# EasyEDA Pro project XRAY.epro, board PCB8
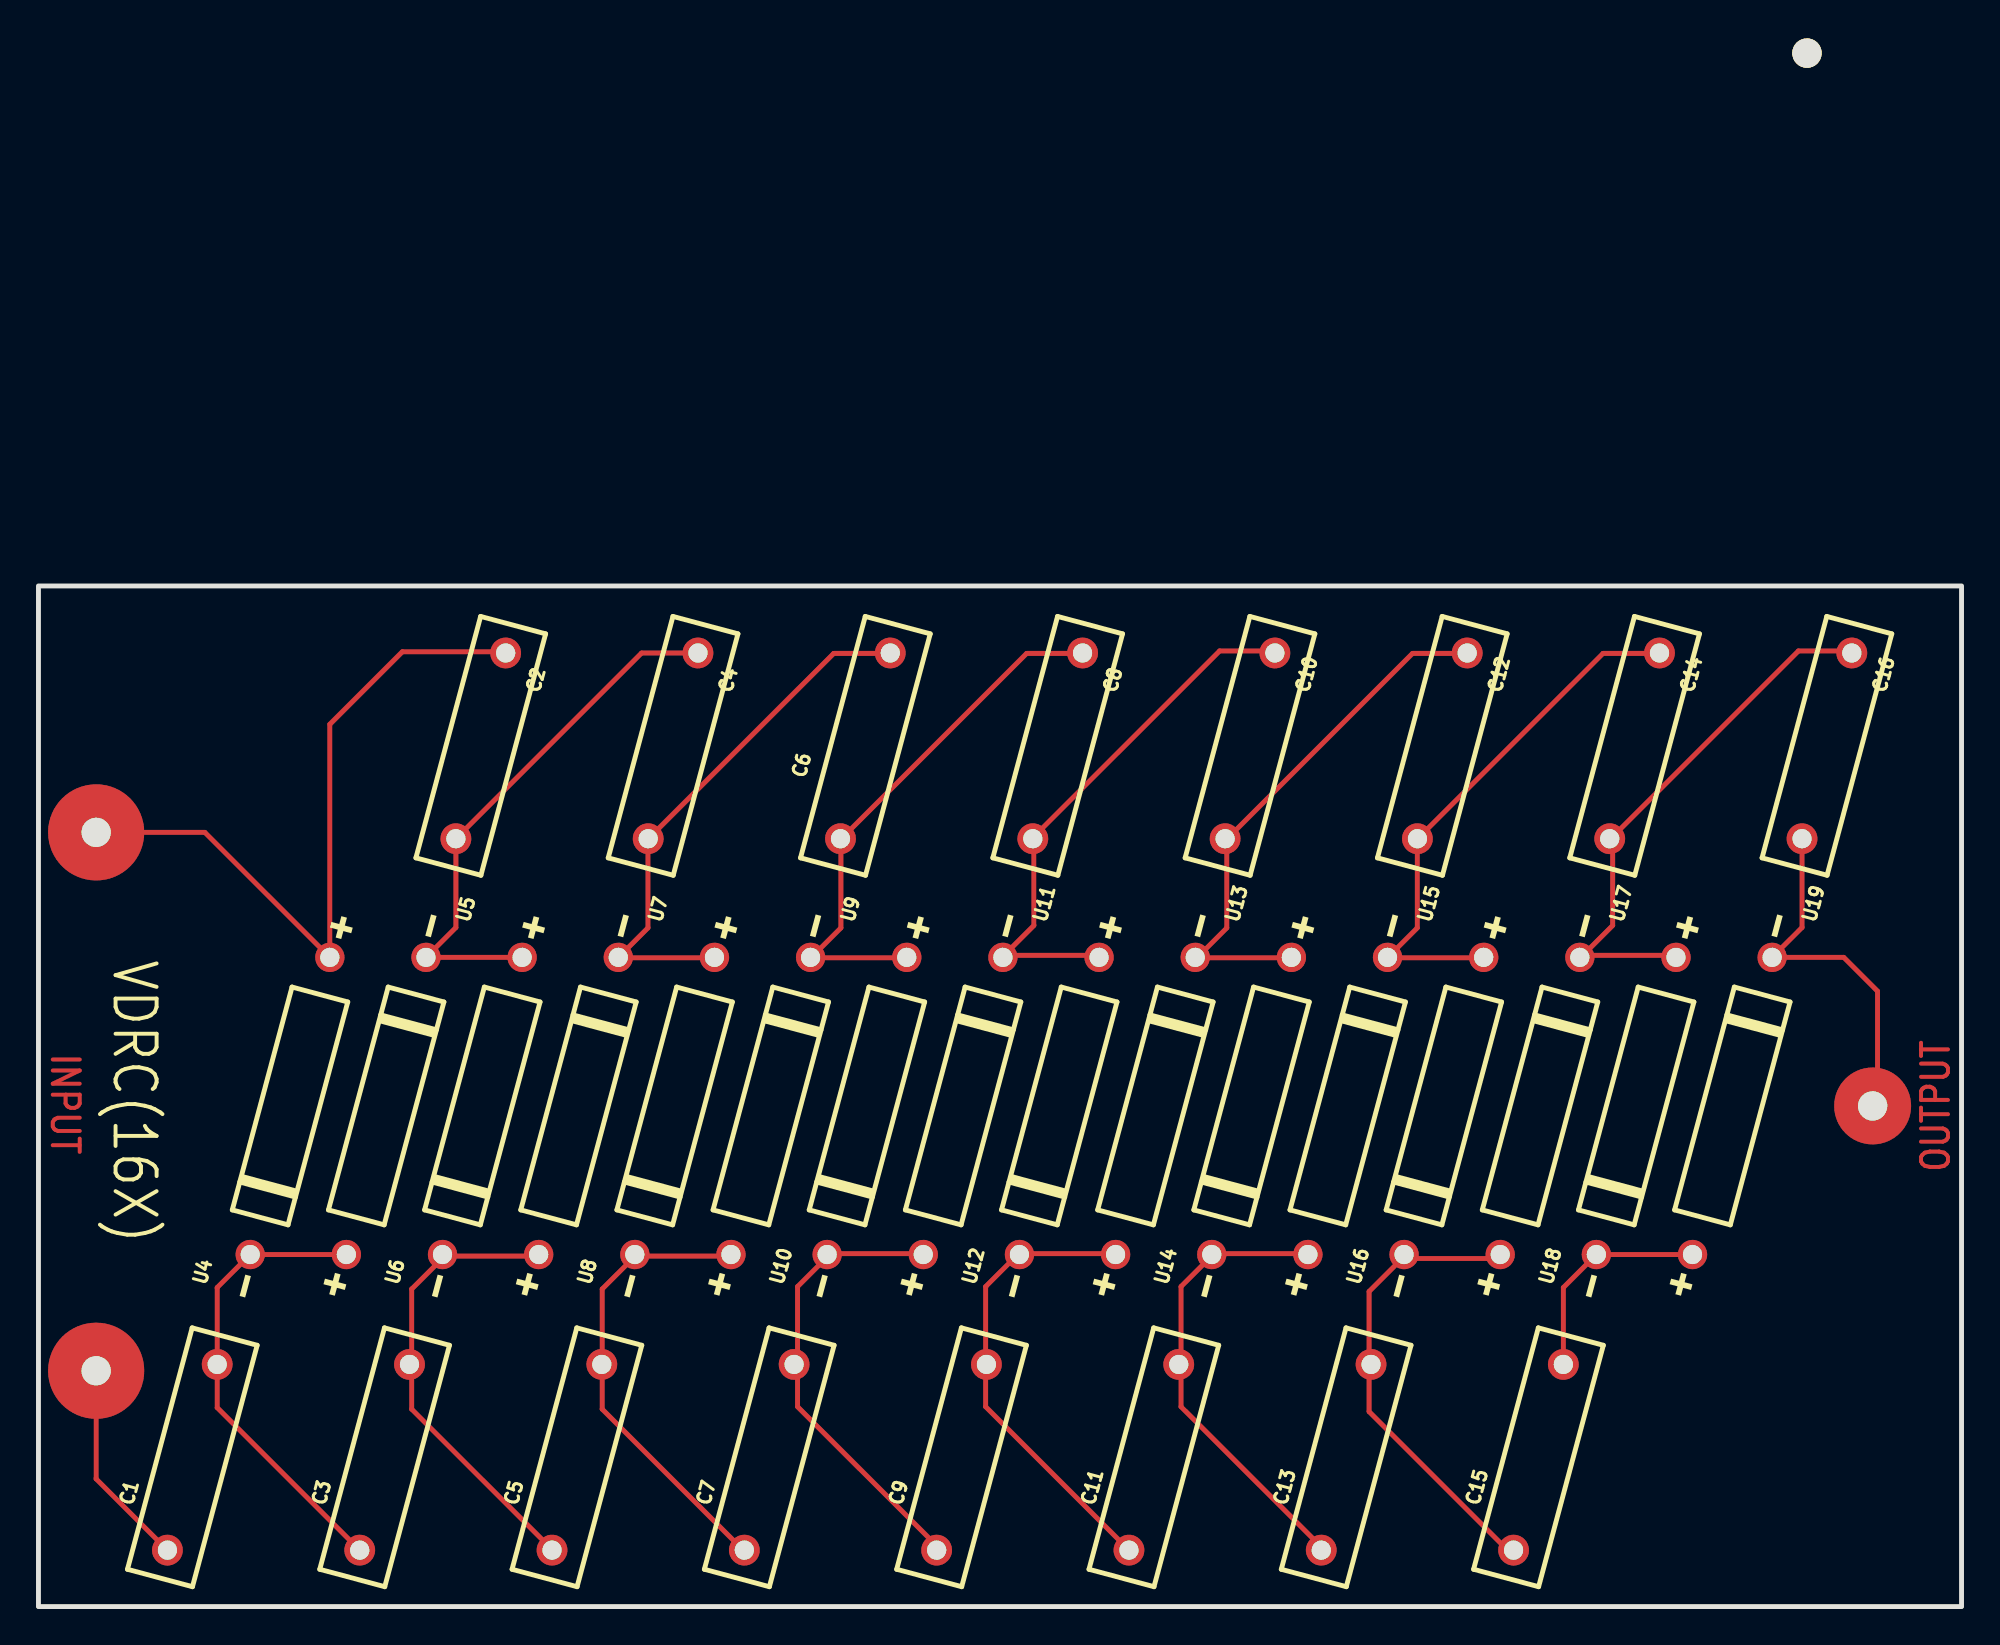
[diagram p5: board, top side]
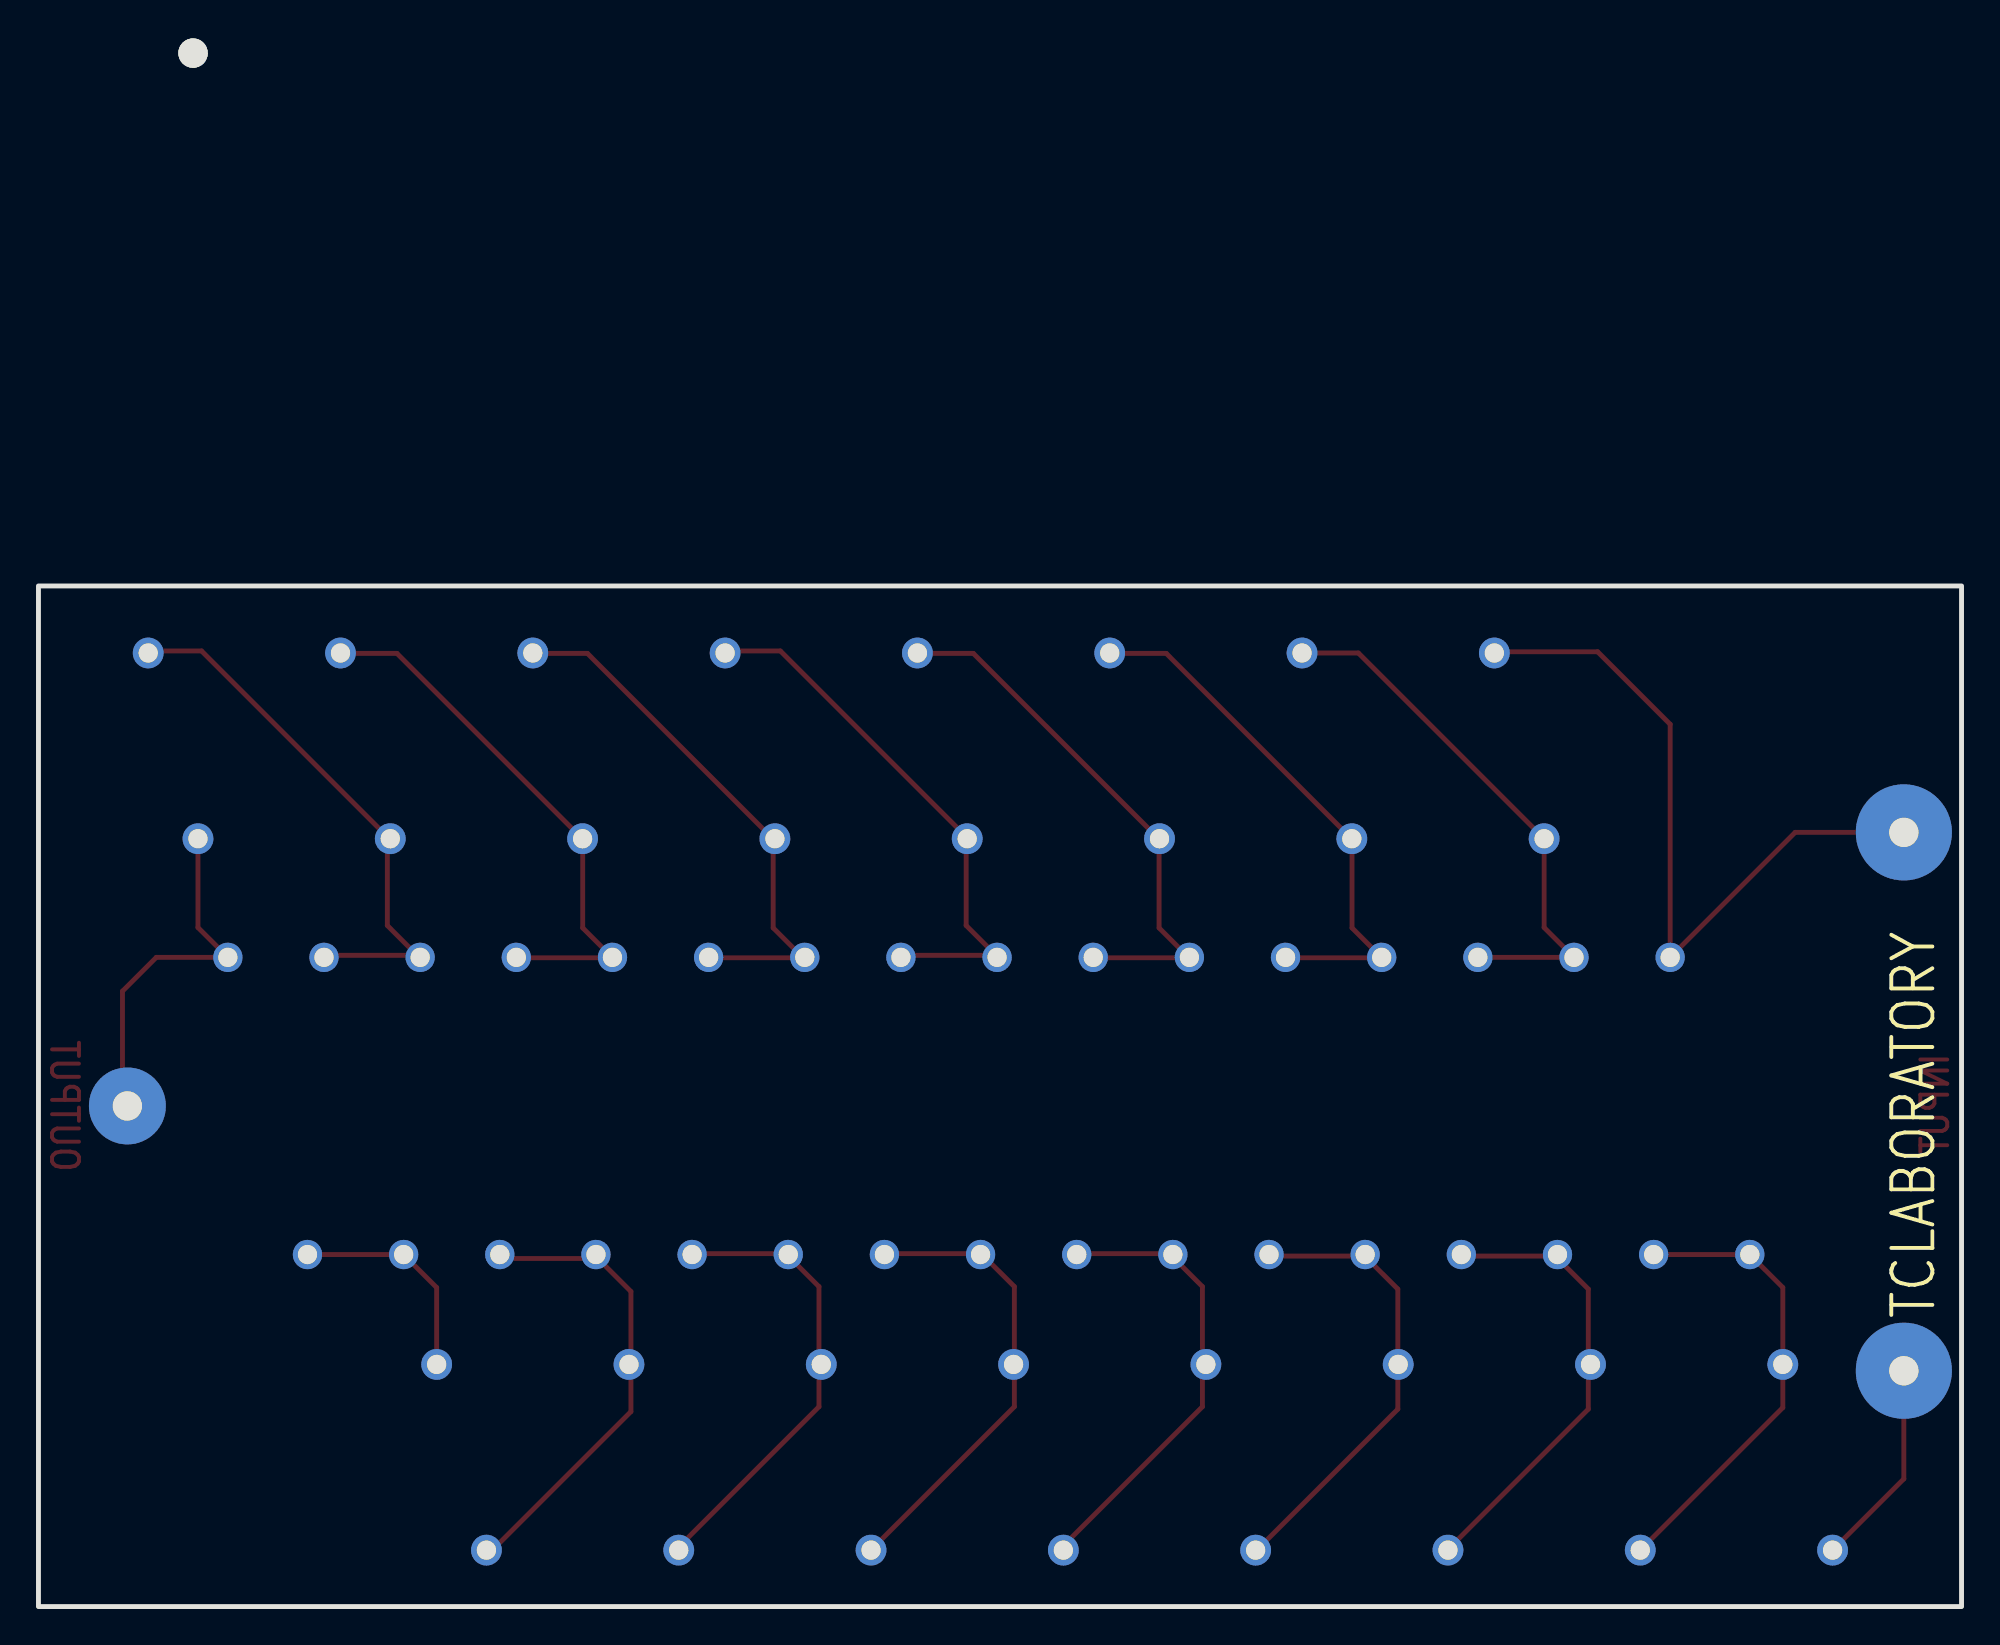
[diagram p6: board, bottom side, seen from below]

Outline 100 x 53.08 mm; copper layers: Top Layer, Bottom Layer. Coordinates in mm from the lower left corner of the outline.
Outline path: rectangle 0,53.08 100,0
Stack: Top Layer 0.035mm / Dielectric1 1.51mm FR4 er 4.5 / Bottom Layer 0.035mm

## Design rules (mm)
template: JLCPCB Capability(Two Layers Board)
spacing copperThickness1oz (default): track to track 0.102, other pairs 0.152 to 0.3
spacing copperThickness2oz: track to track 0.203, other pairs 0.152 to 0.3
track width copperThickness1oz (default): min 0.127, default 0.254, max 2.54
track width copperThickness2oz: min 0.203, default 0.254, max 2.54
differential pair differentialPair (default): width min 0.127, default 0.254, max 2.54; gap min 0.152, default 0.152
via viaSize (default): diameter min 0.5, default 0.61, max 10; hole min 0.3, default 0.305, max 6.3

## Placement (name value [footprint] x y rotation side)
C1  10nF  [CAP-TH_L13.0-W3.5-P10.00-D1.0]  8 7.76 75 top
C2  10nF  [CAP-TH_L13.0-W3.5-P10.00-D1.0]  23 44.76 255 top
C3  10nF  [CAP-TH_L13.0-W3.5-P10.00-D1.0]  18 7.76 75 top
C4  10nF  [CAP-TH_L13.0-W3.5-P10.00-D1.0]  33 44.76 255 top
C5  10nF  [CAP-TH_L13.0-W3.5-P10.00-D1.0]  28 7.76 75 top
C6  10nF  [CAP-TH_L13.0-W3.5-P10.00-D1.0]  43 44.76 255 top
C7  10nF  [CAP-TH_L13.0-W3.5-P10.00-D1.0]  38 7.76 75 top
C8  10nF  [CAP-TH_L13.0-W3.5-P10.00-D1.0]  53 44.76 255 top
C9  10nF  [CAP-TH_L13.0-W3.5-P10.00-D1.0]  48 7.76 75 top
C10  10nF  [CAP-TH_L13.0-W3.5-P10.00-D1.0]  63 44.76 255 top
C11  10nF  [CAP-TH_L13.0-W3.5-P10.00-D1.0]  58 7.76 75 top
C12  10nF  [CAP-TH_L13.0-W3.5-P10.00-D1.0]  73 44.76 255 top
C13  10nF  [CAP-TH_L13.0-W3.5-P10.00-D1.0]  68 7.76 75 top
C14  10nF  [CAP-TH_L13.0-W3.5-P10.00-D1.0]  83 44.76 255 top
C15  10nF  [CAP-TH_L13.0-W3.5-P10.00-D1.0]  78 7.76 75 top
C16  10nF  [CAP-TH_L13.0-W3.5-P10.00-D1.0]  93 44.76 255 top
NOREF  -  [Pad_e34]  3 12.26 0 top
NOREF#2  -  [Pad_e35]  91.96 80.79 0 top
NOREF#3  -  [Pad_e39]  3 40.26 0 top
NOREF#4  -  [Pad_e1996]  95.38 26.04 0 top
U4  2CL77  [DIO-TH_BD3.0-L12.0-P16.00-D0.6]  13.08 26.04 75 top
U5  2CL77  [DIO-TH_BD3.0-L12.0-P16.00-D0.6]  18.08 26.04 255 top
U6  2CL77  [DIO-TH_BD3.0-L12.0-P16.00-D0.6]  23.08 26.04 75 top
U7  2CL77  [DIO-TH_BD3.0-L12.0-P16.00-D0.6]  28.08 26.04 255 top
U8  2CL77  [DIO-TH_BD3.0-L12.0-P16.00-D0.6]  33.08 26.04 75 top
U9  2CL77  [DIO-TH_BD3.0-L12.0-P16.00-D0.6]  38.08 26.04 255 top
U10  2CL77  [DIO-TH_BD3.0-L12.0-P16.00-D0.6]  43.08 26.04 75 top
U11  2CL77  [DIO-TH_BD3.0-L12.0-P16.00-D0.6]  48.08 26.04 255 top
U12  2CL77  [DIO-TH_BD3.0-L12.0-P16.00-D0.6]  53.08 26.04 75 top
U13  2CL77  [DIO-TH_BD3.0-L12.0-P16.00-D0.6]  58.08 26.04 255 top
U14  2CL77  [DIO-TH_BD3.0-L12.0-P16.00-D0.6]  63.08 26.04 75 top
U15  2CL77  [DIO-TH_BD3.0-L12.0-P16.00-D0.6]  68.08 26.04 255 top
U16  2CL77  [DIO-TH_BD3.0-L12.0-P16.00-D0.6]  73.08 26.04 75 top
U17  2CL77  [DIO-TH_BD3.0-L12.0-P16.00-D0.6]  78.08 26.04 255 top
U18  2CL77  [DIO-TH_BD3.0-L12.0-P16.00-D0.6]  83.08 26.04 75 top
U19  2CL77  [DIO-TH_BD3.0-L12.0-P16.00-D0.6]  88.08 26.04 255 top

## Footprints (pads in the part's own frame, mm; a bottom-side part is the same pattern mirrored in y, then rotated)
CAP-TH_L13.0-W3.5-P10.00-D1.0
  round 1.6 hole 1: 1(-5,0) 2(5,0)
DIO-TH_BD3.0-L12.0-P16.00-D0.6
  round 1.524 hole 1: 1(-8,0) 2(8,0)
Pad_e34
  round 5 hole 1.524: 3(0,0)
Pad_e35
  round 1.524 hole 5: 3(0,0)
Pad_e39
  round 5 hole 1.524: 3(0,0)
Pad_e1996
  round 4 hole 1.524x1.3: 3(0,0)

## Nets
As in the schematic, except:
$1N865: C2.1 NOREF#3.3 U4.2
$1N866: C1.1 NOREF.3
$1N3214: C16.2 NOREF#4.3 U19.1

## Routing (per net, layer and track width the routed paths; a pad name or vN(x,y) marks a point on that pad's centre or on a via; arc(x,y) is an arc through that point)
$1N855: length 28.4
  Top Layer w0.254: C4.1 31.37,49.59 C2.2 21.71,35.32 U5.1 U6.2
$1N856: length 24.2
  Top Layer w0.254: U5.2 U4.1 9.29,16.59 C1.2 9.29,10.35 C3.1
$1N857: length 28.4
  Top Layer w0.254: 44.28,49.57 41.35,49.57 31.69,39.91 31.69,35.3 30.14,33.74 35.14,33.74
$1N858: length 24.2
  Top Layer w0.254: 26.82,2.85 19.41,10.27 19.41,16.51 21.12,18.23 26.12,18.23
$1N859: length 28.4
  Top Layer w0.254: 45.17,33.74 40.17,33.74 41.73,35.3 41.73,39.91 51.39,49.57 54.32,49.57
$1N860: length 24.2
  Top Layer w0.254: 36.03,18.23 31.03,18.23 29.31,16.51 29.31,10.27 36.73,2.85
$1N861: length 28.4
  Top Layer w0.254: 55.21,33.87 50.21,33.87 51.76,35.42 51.76,40.04 61.42,49.7 64.35,49.7
$1N862: length 24.2
  Top Layer w0.254: 46.89,2.98 39.47,10.39 39.47,16.64 41.19,18.36 46.19,18.36
$1N863: length 28.4
  Top Layer w0.254: 74.38,49.57 71.45,49.57 61.79,39.91 61.79,35.3 60.24,33.74 65.24,33.74
$1N864: length 24.2
  Top Layer w0.254: 55.97,18.36 50.97,18.36 49.25,16.64 49.25,10.39 56.66,2.98
$1N865: length 37.7
  Top Layer w0.254: NOREF#3.3 8.65,40.26 U4.2 15.15,45.89 18.92,49.66 24.23,49.66 C2.1
$1N866: length 10.9
  Top Layer w0.254: C1.1 3,6.64 NOREF.3
$1N1482: length 24.2
  Top Layer w0.254: 66.82,2.98 59.41,10.39 59.41,16.64 61.13,18.36 66.13,18.36
$1N3211: length 28.4
  Top Layer w0.254: 84.29,49.57 81.36,49.57 71.7,39.91 71.7,35.3 70.14,33.74 75.14,33.74
$1N3212: length 28.4
  Top Layer w0.254: 85.3,33.87 80.3,33.87 81.86,35.42 81.86,40.04 91.52,49.7 94.45,49.7
$1N3213: length 24.2
  Top Layer w0.254: 75.91,18.1 70.91,18.1 69.19,16.39 69.19,10.14 76.6,2.73
$1N3214: length 19
  Top Layer w0.254: 95.63,26.04 95.63,32 93.87,33.76 U19.1 91.71,35.32 C16.2
$1N3215: length 11.4
  Top Layer w0.254: C15.2 79.29,16.59 U18.1 U19.2

## Text on the board
Bottom Silkscreen Layer: TCLABORATORY
Top Layer: INPUT | OUTPUT
Top Silkscreen Layer: VDRC(16X)
